# EAGLE design 50mil_5x2_JTAG_to_100mil_5x2_v20 (EAGLE 7.1.0)
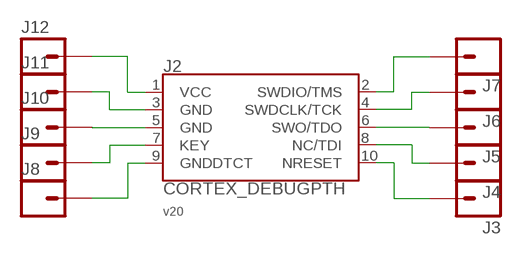
[diagram p0: schematic, sheet 1]

## Parts
J2  CORTEX_DEBUGPTH  [2X5-PTH-1.27MM]
J3  M01OFFSET  [1X01_OFFSET]
J4  M01OFFSET  [1X01_OFFSET]
J5  M01OFFSET  [1X01_OFFSET]
J6  M01OFFSET  [1X01_OFFSET]
J7  M01OFFSET  [1X01_OFFSET]
J8  M01OFFSET  [1X01_OFFSET]
J9  M01OFFSET  [1X01_OFFSET]
J10  M01OFFSET  [1X01_OFFSET]
J11  M01OFFSET  [1X01_OFFSET]
J12  M01OFFSET  [1X01_OFFSET]

## Nets
N$1: J2.10(NRESET) J3.1
N$2: J2.8(NC/TDI) J4.1
N$3: J2.6(SWO/TDO) J5.1
N$4: J2.4(SWDCLK/TCK) J6.1
N$5: J2.2(SWDIO/TMS) J7.1
N$6: J2.1(VCC) J12.1
N$7: J2.3(GND) J11.1
N$8: J2.5(GND) J10.1
N$9: J2.7(KEY) J9.1
N$10: J2.9(GNDDTCT) J8.1

## Notes on the sheet
- v20

## Library data of the parts
J2 = SparkFun-Connectors:CORTEX_DEBUG: Cortex Debug Connector Datasheet <http://infocenter.arm.com/help/topic/com.arm.doc.faqs/attached/13634/cortex_debug_connectors.pdf>
J3-J12 = SparkFun-Connectors:M01: Header 1 Standard 1-pin 0.1" header. Use with straight break away headers (SKU : PRT-00116), right angle break away headers (PRT-00553), swiss pins (PRT-00743), machine pins (PRT-00117), and female headers (PRT-00115). SMTSO-256-ET is a "flush mount" nut for a 4-40 screw. The older package used to be too tight, and did not allow it to sit properly thru the drill hit. The latest (0.165DIA) fits nice and snug.

## Board
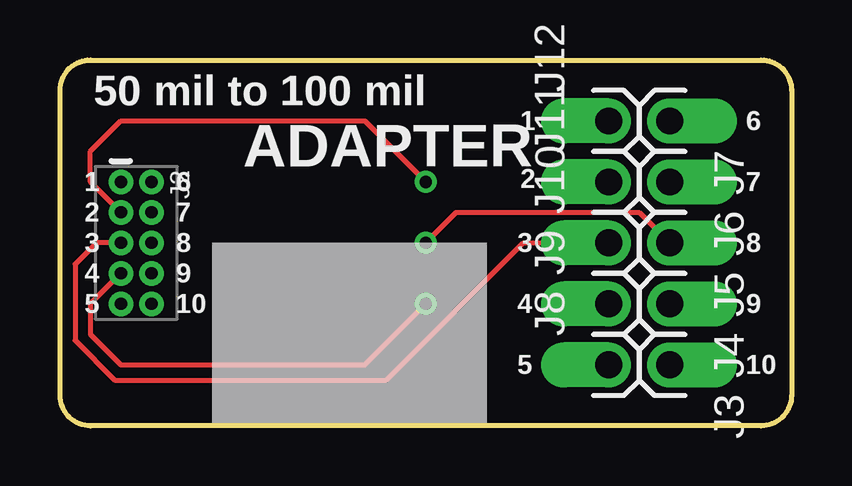
[diagram p1: board, top side]
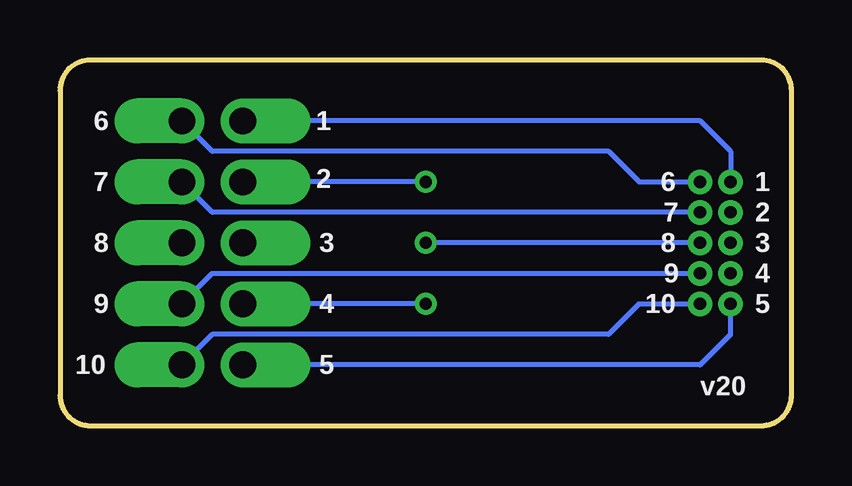
[diagram p2: board, bottom side, seen from below]

Size 30.48 x 15.24 mm. Coordinates in mm from the lower left corner, seen from the top.
Outline: 0,13.97 arc-90 1.27,15.24 29.21,15.24 arc-90 30.48,13.97 30.48,1.27 arc-90 29.21,0 1.27,0 arc-90 0,1.27 0,13.97
Copper layers (1*16): Top 0.035mm / dielectric 1.5mm / Bottom 0.035mm
Design rules "default": minimum track width 10mil, minimum drill 0.6mm, track to track 8mil, track to pad 8mil, pad to pad 8mil, via to via 8mil, smd to smd 8mil, copper to edge 40mil, drill to drill 8mil, minimum pad ring 10mil, minimum via ring 8mil, stop-mask expansion 4mil, vias tented up to drill 0mil, thermal gap 10mil

### Footprints (pad centres in the part's own frame; a part is rotated, then mirrored left to right if it is on the bottom)
2X5-PTH-1.27MM = drill 0.508 pad 1: 1 -2.54,-0.635; 2 -2.54,0.635; 3 -1.27,-0.635; 4 -1.27,0.635; 5 0,-0.635; 6 0,0.635; 7 1.27,-0.635; 8 1.27,0.635; 9 2.54,-0.635; 10 2.54,0.635
1X01_OFFSET = drill 1.118 pad 1.88 offset: 1 0,0

### Placement (x,y rotation side)
J2  3.17,7.62 270 top
J3  25.4,2.54 270 top
J4  25.4,5.08 270 top
J5  25.4,7.62 270 top
J6  25.4,10.16 270 top
J7  25.4,12.7 270 top
J8  22.86,2.54 90 top
J9  22.86,5.08 90 top
J10  22.86,7.62 90 top
J11  22.86,10.16 90 top
J12  22.86,12.7 90 top

### Tracks (layer width: path | path; a pad name or v marks a point on that pad's centre or on a via)
N$1
  Bottom 0.203: J3.1 24.13,3.81 7.62,3.81 6.35,5.08 J2.10
N$2
  Bottom 0.203: J4.1 24.13,6.35 J2.8
N$3  (via drill 0.51)
  Top 0.203: v15.24,7.62 16.51,8.89 24.13,8.89 J5.1
  Bottom 0.203: J2.6 v15.24,7.62
N$4
  Bottom 0.203: J6.1 24.13,8.89 J2.4
N$5
  Bottom 0.203: J7.1 24.13,11.43 7.62,11.43 6.35,10.16 J2.2
N$6
  Bottom 0.203: J12.1 3.81,12.7 2.54,11.43 J2.1
N$7  (via drill 0.51)
  Top 0.203: v15.24,10.16 12.7,12.7 2.54,12.7 1.27,11.43 1.27,10.16 J2.3
  Bottom 0.203: v15.24,10.16 J11.1
N$8
  Top 0.203: J2.5 1.52,7.62 0.63,6.73 0.63,3.56 2.29,1.91 13.59,1.91 19.3,7.62 J10.1
N$9  (via drill 0.51)
  Top 0.203: v15.24,5.08 12.7,2.54 2.54,2.54 1.27,3.81 1.27,5.08 J2.7
  Bottom 0.203: v15.24,5.08 J9.1
N$10
  Bottom 0.203: J8.1 3.81,2.54 2.54,3.81 J2.9

### Text on the board
tPlace: 50 mil to 100 mil | 1 | 6 | ADAPTER | 1 | 6 | 2 | 7 | 2 | 7 | 3 | 8 | 3 | 8 | 4 | 9 | 5 | 10 | 4 | 9 | 5 | 10
bPlace: 1 | 6 | 1 | 6 | 2 | 7 | 2 | 7 | 3 | 8 | 3 | 8 | 4 | 9 | 5 | 10 | 4 | 9 | 5 | 10 | v20